# Altium project Controller_TRK.PrjPcb
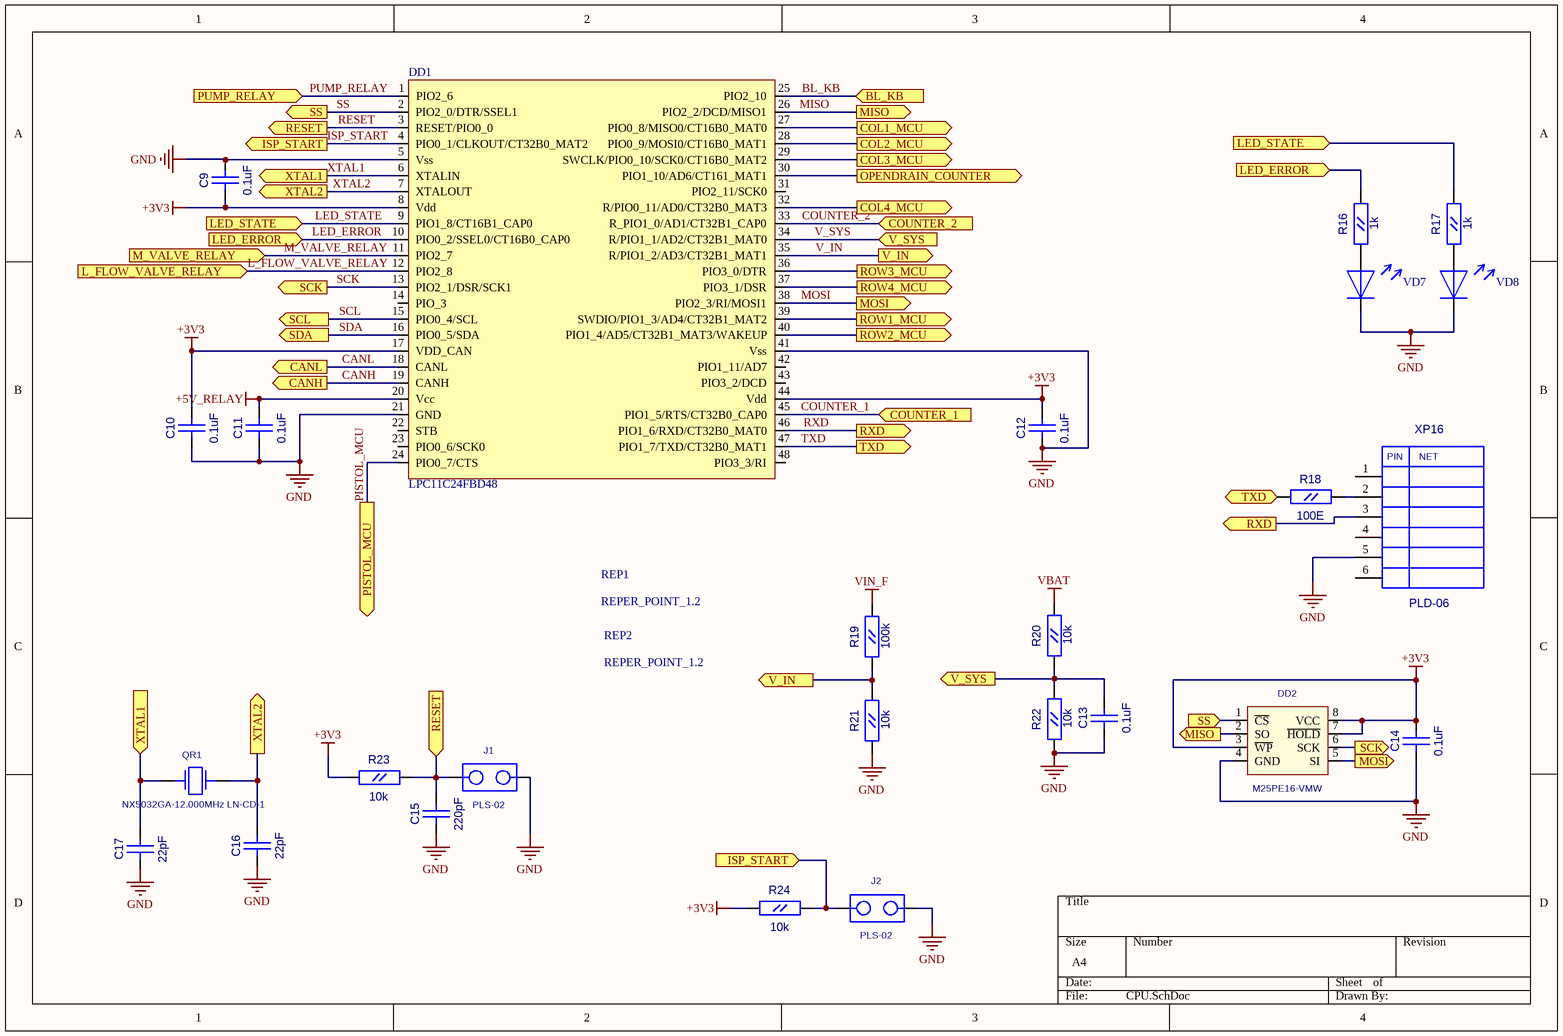
[diagram p0: CPU.SchDoc]
9 sheets, 192 parts. Net scope: flat (ports and power ports of the same name join across sheets).
Board file: Controller_TRK.PcbDoc
Sheets:
  CPU.SchDoc
  Keyboard.SchDoc
  Connections.SchDoc
  Relay.SchDoc
  Input.SchDoc
  Battery.SchDoc
  Power.SchDoc
  Power_1.SchDoc
  5V_Source.SchDoc

## Sheet CPU.SchDoc
size A4

### Parts
C9  0.1uF  [CC0603]
C10  0.1uF  [CC0603]
C11  0.1uF  [CC0603]
C12  0.1uF  [CC0603]
C13  0.1uF  [CC0603]
C14  0.1uF  [CC0603]
C15  220pF  [CC0603]
C16  22pF  [CC0603]
C17  22pF  [CC0603]
DD1  LPC11C24FBD48  [LQFP-48]
DD2  M25PE16-VMW  [EIAJ_SO8]
J1  PLS-02  [PLS-02]
J2  PLS-02  [PLS-02]
QR1  NX5032GA-12.000MHz LN-CD-1  [AC5032_2]
R16  1k  [RC0603]
R17  1k  [RC0603]
R18  100E  [RC0603]
R19  100k  [RC0603]
R20  10k  [RC0603]
R21  10k  [RC0603]
R22  10k  [RC0603]
R23  10k  [RC0603]
R24  10k  [RC0603]
REP1  REPER_POINT_1.2  [REPER1.2]
REP2  REPER_POINT_1.2  [REPER1.2]
VD7  LED_0805  [LED0805]  (value not drawn)
VD8  LED_0805  [LED0805]  (value not drawn)
XP16  PLD-06  [PIN6]

### Ports
BL_KB (in), CANH (out), CANL (out), COL1_MCU (out), COL2_MCU (out), COL3_MCU (out), COL4_MCU (out), COUNTER_1 (in), COUNTER_2 (in), ISP_START (in), ISP_START (out), L_FLOW_VALVE_RELAY (in), LED_ERROR (in), LED_STATE (in), M_VALVE_RELAY (in), MISO, MISO (out), MOSI, MOSI (out), OPENDRAIN_COUNTER (out), PISTOL_MCU (out), PUMP_RELAY (in), RESET (in), RESET (out), ROW1_MCU (out), ROW2_MCU (out), ROW3_MCU (out), ROW4_MCU (out), RXD (out), SCK, SCK (out), SCL (out), SDA (out), SS (in), SS (out), TXD (in), TXD (out), V_IN (out), V_SYS (in), V_SYS (out), XTAL1 (in), XTAL1 (out), XTAL2 (out)

### Nets
+3V3: C9.1(A) C10.2(B) C12.2(B) C14.2(B) DD1.8(Vdd) DD1.17(VDD_CAN) DD1.44(Vdd) DD2.3(~{WP}) DD2.7(~{HOLD}) DD2.8(VCC) R23.1(A) R24.1(A)
+5V_RELAY: C11.2(B) DD1.20(Vcc)
GND: C9.2(B) C10.1(A) C11.1(A) C12.1(A) C13.1(A) C14.1(A) C15.1(A) C16.1(A) C17.1(A) DD1.5(Vss) DD1.21(GND) DD1.41(Vss) DD2.4(GND) J1.2 J2.2 R21.1(A) R22.1(A) VD7.2 VD8.2 XP16.5
VBAT: R20.2(B)
VIN_F: R19.2(B)
BL_KB: DD1.25(PIO2_10) ; port BL_KB
CANH: DD1.19(CANH) ; port CANH
CANL: DD1.18(CANL) ; port CANL
COUNTER_1: DD1.45(PIO1_5/RTS/CT32B0_CAP0) ; port COUNTER_1
COUNTER_2: DD1.33(R_PIO1_0/AD1/CT32B1_CAP0) ; port COUNTER_2
ISP_START: DD1.4(PIO0_1/CLKOUT/CT32B0_MAT2) J2.1 R24.2(B) ; port ISP_START
L_FLOW_VALVE_RELAY: DD1.12(PIO2_8) ; port L_FLOW_VALVE_RELAY
LED_ERROR: DD1.10(PIO0_2/SSEL0/CT16B0_CAP0) R16.2(B) ; port LED_ERROR
LED_STATE: DD1.9(PIO1_8/CT16B1_CAP0) R17.2(B) ; port LED_STATE
M_VALVE_RELAY: DD1.11(PIO2_7) ; port M_VALVE_RELAY
MISO: DD1.26(PIO2_2/DCD/MISO1) DD2.2(SO) ; port MISO
MOSI: DD1.38(PIO2_3/RI/MOSI1) DD2.5(SI) ; port MOSI
PISTOL_MCU: DD1.24(PIO0_7/CTS) ; port PISTOL_MCU
PUMP_RELAY: DD1.1(PIO2_6) ; port PUMP_RELAY
RESET: C15.2(B) DD1.3(RESET/PIO0_0) J1.1 R23.2(B) ; port RESET
RXD: DD1.46(PIO1_6/RXD/CT32B0_MAT0) XP16.3 ; port RXD
SCK: DD1.13(PIO2_1/DSR/SCK1) DD2.6(SCK) ; port SCK
SCL: DD1.15(PIO0_4/SCL) ; port SCL
SDA: DD1.16(PIO0_5/SDA) ; port SDA
SS: DD1.2(PIO2_0/DTR/SSEL1) DD2.1(~{CS}) ; port SS
TXD: DD1.47(PIO1_7/TXD/CT32B0_MAT1) R18.1(A) ; port TXD
V_IN: DD1.35(R/PIO1_2/AD3/CT32B1_MAT1) R19.1(A) R21.2(B) ; port V_IN
V_SYS: C13.2(B) DD1.34(R/PIO1_1/AD2/CT32B1_MAT0) R20.1(A) R22.2(B) ; port V_SYS
XTAL1: C17.2(B) DD1.6(XTALIN) QR1.1 ; port XTAL1
XTAL2: C16.2(B) DD1.7(XTALOUT) QR1.2 ; port XTAL2
NetDD1_27: DD1.27(PIO0_8/MISO0/CT16B0_MAT0) ; port COL1_MCU
NetDD1_28: DD1.28(PIO0_9/MOSI0/CT16B0_MAT1) ; port COL2_MCU
NetDD1_29: DD1.29(SWCLK/PIO0_10/SCK0/CT16B0_MAT2) ; port COL3_MCU
NetDD1_30: DD1.30(PIO1_10/AD6/CT161_MAT1) ; port OPENDRAIN_COUNTER
NetDD1_32: DD1.32(R/PIO0_11/AD0/CT32B0_MAT3) ; port COL4_MCU
NetDD1_36: DD1.36(PIO3_0/DTR) ; port ROW3_MCU
NetDD1_37: DD1.37(PIO3_1/DSR) ; port ROW4_MCU
NetDD1_39: DD1.39(SWDIO/PIO1_3/AD4/CT32B1_MAT2) ; port ROW1_MCU
NetDD1_40: DD1.40(PIO1_4/AD5/CT32B1_MAT3/WAKEUP) ; port ROW2_MCU
NetR16_1: R16.1(A) VD7.1
NetR17_1: R17.1(A) VD8.1
NetR18_2: R18.2(B) XP16.2

Not connected (* = marked no-connect by the designer): DD1 14(PIO_3) 22(STB) 23(PIO0_6/SCK0) 31(PIO2_11/SCK0) 42(PIO1_11/AD7) 43(PIO3_2/DCD) 48(PIO3_3/RI); REP1 1; REP2 1; XP16 1 4 6

### Notes on the sheet
- (in symbol PLD-06) PIN; NET

### Library data of the parts
C9-C17 = CC0603
  C9-C14: Value: 0.1uF
  C15: Value: 220pF
  C16 C17: Value: 22pF
DD2 = S25FL016A0LMFI01: Value: M25PE16-VMW
QR1 = AC5032_2: AC5032/2; Value: NX5032GA-12.000MHz LN-CD-1
R16-R24 = RC0603
  R16 R17: Value: 1k
  R18: Value: 100E
  R19: Value: 100k
  R20-R24: Value: 10k
REP1 REP2 = REPER1.2: Value: REPER_POINT_1.2
XP16 = PLD-06: PLD06; Value: *
DD1 = LPC11C24FBD48: Value: LPC11C24FBD48
J1 J2 = PLS-02: Value: *
VD7 VD8 = LED_0805: Value: LED_0805

## Sheet Keyboard.SchDoc
size A4
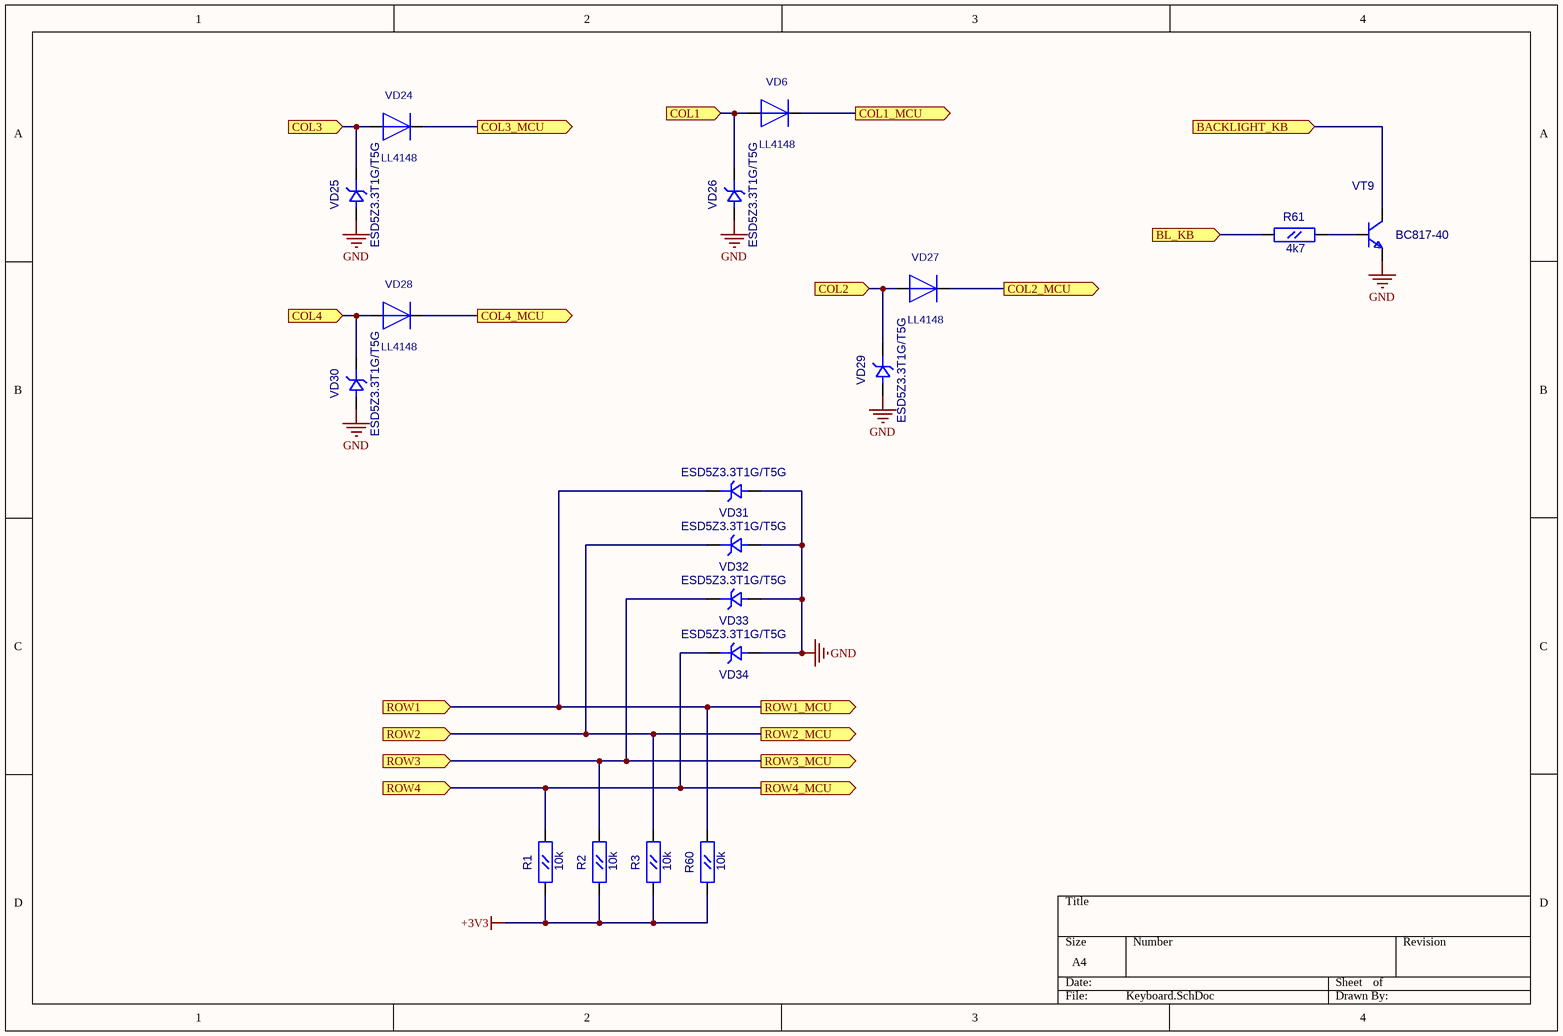
[diagram p1: Keyboard.SchDoc]

### Parts
R1  10k  [RC0603]
R2  10k  [RC0603]
R3  10k  [RC0603]
R60  10k  [RC0603]
R61  4k7  [RC0603]
VD6  LL4148  [SOD-80]
VD24  LL4148  [SOD-80]
VD25  ESD5Z3.3T1G/T5G  [SOD-523]
VD26  ESD5Z3.3T1G/T5G  [SOD-523]
VD27  LL4148  [SOD-80]
VD28  LL4148  [SOD-80]
VD29  ESD5Z3.3T1G/T5G  [SOD-523]
VD30  ESD5Z3.3T1G/T5G  [SOD-523]
VD31  ESD5Z3.3T1G/T5G  [SOD-523]
VD32  ESD5Z3.3T1G/T5G  [SOD-523]
VD33  ESD5Z3.3T1G/T5G  [SOD-523]
VD34  ESD5Z3.3T1G/T5G  [SOD-523]
VT9  BC817-40  [SOT-23(123)]

### Ports
BACKLIGHT_KB (in), BL_KB (in), COL1 (in), COL1_MCU (out), COL2 (in), COL2_MCU (out), COL3 (in), COL3_MCU (out), COL4 (in), COL4_MCU (out), ROW1 (in), ROW1_MCU (out), ROW2 (in), ROW2_MCU (out), ROW3 (in), ROW3_MCU (out), ROW4 (in), ROW4_MCU (out)

### Nets
+3V3: R1.1(A) R2.1(A) R3.1(A) R60.1(A)
GND: VD25.1(A) VD26.1(A) VD29.1(A) VD30.1(A) VD31.1(A) VD32.1(A) VD33.1(A) VD34.1(A) VT9.2(E)
BL_KB: R61.1(A) ; port BL_KB
NetDD1_27: VD6.2(+) ; port COL1_MCU
NetDD1_28: VD27.2(+) ; port COL2_MCU
NetDD1_29: VD24.2(+) ; port COL3_MCU
NetDD1_32: VD28.2(+) ; port COL4_MCU
NetDD1_36: R2.2(B) VD33.2(K) ; port ROW3_MCU, port ROW3
NetDD1_37: R1.2(B) VD34.2(K) ; port ROW4_MCU, port ROW4
NetDD1_39: R60.2(B) VD31.2(K) ; port ROW1_MCU, port ROW1
NetDD1_40: R3.2(B) VD32.2(K) ; port ROW2_MCU, port ROW2
NetR61_2: R61.2(B) VT9.1(B)
NetVD6_1: VD6.1(-) VD26.2(K) ; port COL1
NetVD24_1: VD24.1(-) VD25.2(K) ; port COL3
NetVD27_1: VD27.1(-) VD29.2(K) ; port COL2
NetVD28_1: VD28.1(-) VD30.2(K) ; port COL4
NetVT9_3: VT9.3(C) ; port BACKLIGHT_KB

### Library data of the parts
R1-R3 R60 R61 = RC0603
  R1-R3 R60: Value: 10k
  R61: Value: 4k7
VD25 VD26 VD29-VD34 = ESD5Z: Supressor; Value: ESD5Z3.3T1G/T5G
VT9 = BC846BLT1: NPN 500ma transistor; ComponentField7: Published 29-Sep-2000; OriginalName: BC846BLT1; Value: BC817-40
VD6 VD24 VD27 VD28 = LL4148: Value: *

## Sheet Connections.SchDoc
size A4
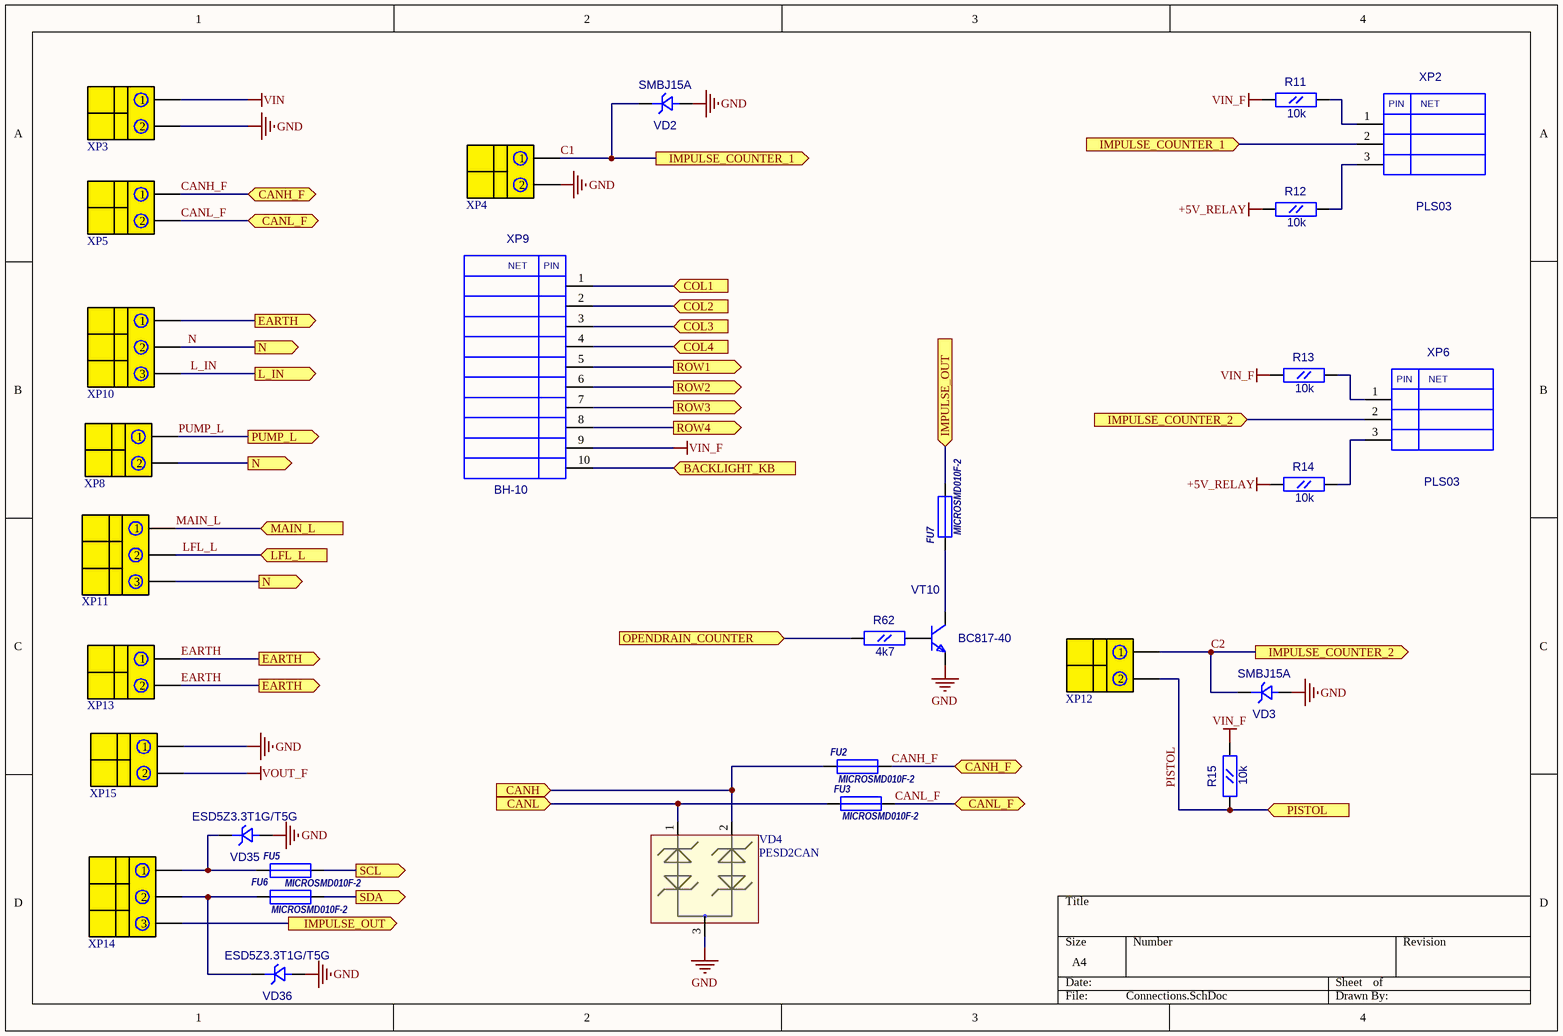
[diagram p2: Connections.SchDoc]

### Parts
FU2  MICROSMD010F-2  [RC1210]
FU3  MICROSMD010F-2  [RC1210]
FU5  MICROSMD010F-2  [RC1210]
FU6  MICROSMD010F-2  [RC1210]
FU7  MICROSMD010F-2  [RC1210]
R11  10k  [RC0603]
R12  10k  [RC0603]
R13  10k  [RC0603]
R14  10k  [RC0603]
R15  10k  [RC0603]
R62  4k7  [RC0603]
VD2  SMBJ15A  [SMB]
VD3  SMBJ15A  [SMB]
VD4  PESD2CAN  [SOT-23(123)]
VD35  ESD5Z3.3T1G/T5G  [SOD-523]
VD36  ESD5Z3.3T1G/T5G  [SOD-523]
VT10  BC817-40  [SOT-23(123)]
XP2  PLS03  [PLS-03]
XP3  DG330-2PIN  [DG330-2PIN]  (value not drawn)
XP4  DG330-2PIN  [DG330-2PIN]  (value not drawn)
XP5  DG330-2PIN  [DG330-2PIN]  (value not drawn)
XP6  PLS03  [PLS-03]
XP8  DG330-2PIN  [DG330-2PIN]  (value not drawn)
XP9  BH-10  [BH-10]
XP10  DG330-3PIN  [DG330-3PIN]  (value not drawn)
XP11  DG330-3PIN  [DG330-3PIN]  (value not drawn)
XP12  DG330-2PIN  [DG330-2PIN]  (value not drawn)
XP13  DG330-2PIN  [DG330-2PIN]  (value not drawn)
XP14  DG330-3PIN  [DG330-3PIN]  (value not drawn)
XP15  DG330-2PIN  [DG330-2PIN]  (value not drawn)

### Ports
BACKLIGHT_KB (in), CANH (in), CANH_F, CANL (in), CANL_F, COL1 (in), COL2 (in), COL3 (in), COL4 (in), EARTH (out), IMPULSE_COUNTER_1 (in), IMPULSE_COUNTER_1 (out), IMPULSE_COUNTER_2 (in), IMPULSE_COUNTER_2 (out), IMPULSE_OUT (in), IMPULSE_OUT (out), L_IN (out), LFL_L (in), MAIN_L (in), N (out), OPENDRAIN_COUNTER (in), PISTOL (in), PUMP_L (out), ROW1 (out), ROW2 (out), ROW3 (out), ROW4 (out), SCL (out), SDA (out)

### Nets
+5V_RELAY: R12.1(A) R14.1(A)
GND: VD2.1(A) VD3.1(A) VD4.3 VD35.1(A) VD36.1(A) VT10.2(E) XP3.2 XP4.2 XP15.1
VIN: XP3.1
VIN_F: R11.1(A) R13.1(A) R15.2(B) XP9.9
VOUT_F: XP15.2
C1: VD2.2(K) XP2.2 XP4.1 ; port IMPULSE_COUNTER_1
C2: VD3.2(K) XP6.2 XP12.1 ; port IMPULSE_COUNTER_2
CANH: FU2.1 VD4.2 ; port CANH
CANH_F: FU2.2 XP5.1 ; port CANH_F
CANL: FU3.1 VD4.1 ; port CANL
CANL_F: FU3.2 XP5.2 ; port CANL_F
EARTH: XP10.1 XP13.1 XP13.2 ; port EARTH
L_IN: XP10.3 ; port L_IN
LFL_L: XP11.2 ; port LFL_L
MAIN_L: XP11.1 ; port MAIN_L
N: XP8.2 XP10.2 XP11.3 ; port N
PISTOL: R15.1(A) XP12.2 ; port PISTOL
PUMP_L: XP8.1 ; port PUMP_L
SCL: FU5.2 ; port SCL
SDA: FU6.2 ; port SDA
NetDD1_30: R62.1(A) ; port OPENDRAIN_COUNTER
NetDD1_36: XP9.7 ; port ROW3
NetDD1_37: XP9.8 ; port ROW4
NetDD1_39: XP9.5 ; port ROW1
NetDD1_40: XP9.6 ; port ROW2
NetFU5_1: FU5.1 VD35.2(K) XP14.1
NetFU6_1: FU6.1 VD36.2(K) XP14.2
NetFU7_1: FU7.1 VT10.3(C)
NetFU7_2: FU7.2 XP14.3 ; port IMPULSE_OUT
NetR11_2: R11.2(B) XP2.1
NetR12_2: R12.2(B) XP2.3
NetR13_2: R13.2(B) XP6.1
NetR14_2: R14.2(B) XP6.3
NetR62_2: R62.2(B) VT10.1(B)
NetVD6_1: XP9.1 ; port COL1
NetVD24_1: XP9.3 ; port COL3
NetVD27_1: XP9.2 ; port COL2
NetVD28_1: XP9.4 ; port COL4
NetVT9_3: XP9.10 ; port BACKLIGHT_KB

### Notes on the sheet
- (in symbol BH-10) NET; PIN
- (in symbol PLS03) PIN; NET

### Library data of the parts
FU2 FU3 FU5-FU7 = MICROSMD
  FU2 FU3 FU5 FU6: Value: MICROSMD010F-2
  FU7: Value: *
R11-R15 R62 = RC0603
  R11-R15: Value: 10k
  R62: Value: 4k7
VD2 VD3 = SMBJ: Value: SMBJ15A
VD4 = PESD2CAN: TVS for CAN
VD35 VD36 = ESD5Z: Supressor; Value: ESD5Z3.3T1G/T5G
VT10 = BC846BLT1: as VT9 on sheet Keyboard; OriginalName: BC846BLT1; Value: BC817-40
XP2 XP6 = PLS03: Value: *
XP3-XP5 XP8 XP12 XP13 XP15 = DG330-2PIN: Value: DG330-2PIN
XP9 = BH-10: Value: *
XP10 XP11 XP14 = DG330-3PIN: Value: DG330-3PIN

## Sheet Relay.SchDoc
size A4
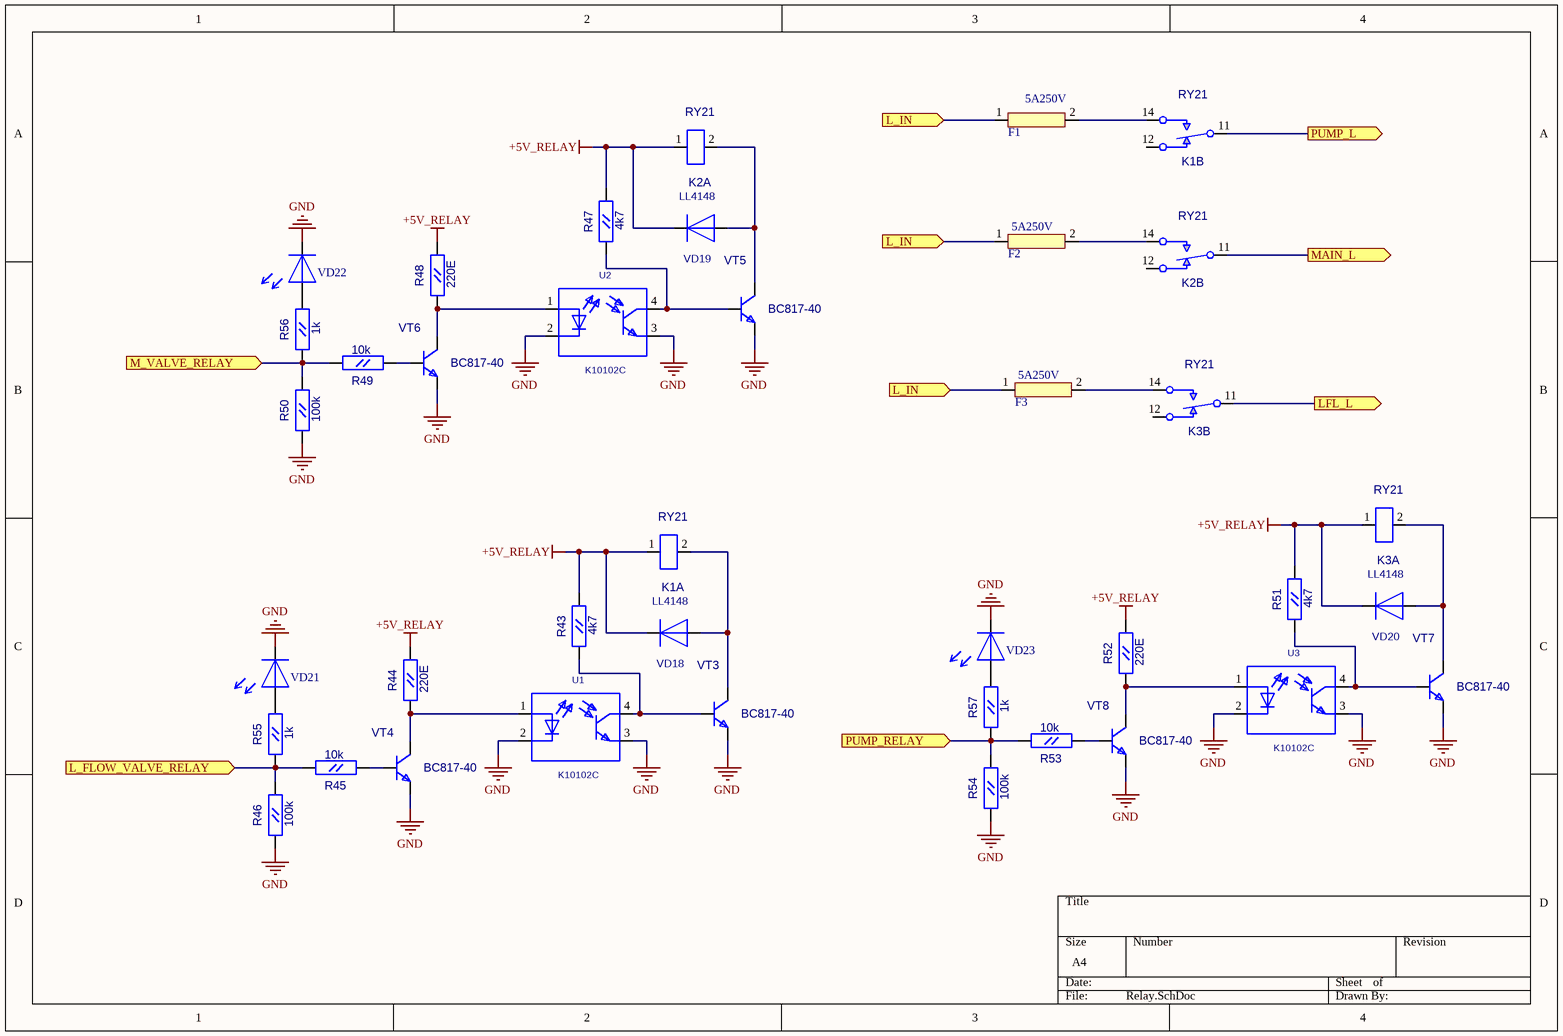
[diagram p3: Relay.SchDoc]

### Parts
F1  KLS5-266(5x20) 2pcs  [Fuse_5x20]  (value not drawn)
F2  KLS5-266(5x20) 2pcs  [Fuse_5x20]  (value not drawn)
F3  KLS5-266(5x20) 2pcs  [Fuse_5x20]  (value not drawn)
K1  RY21  [RY21_RY21(Primary)]  (parts A,B of 2)
K2  RY21  [RY21_RY21(Primary)]  (parts A,B of 2)
K3  RY21  [RY21_RY21(Primary)]  (parts A,B of 2)
R43  4k7  [RC0603]
R44  220E  [RC0603]
R45  10k  [RC0603]
R46  100k  [RC0603]
R47  4k7  [RC0603]
R48  220E  [RC0603]
R49  10k  [RC0603]
R50  100k  [RC0603]
R51  4k7  [RC0603]
R52  220E  [RC0603]
R53  10k  [RC0603]
R54  100k  [RC0603]
R55  1k  [RC0603]
R56  1k  [RC0603]
R57  1k  [RC0603]
U1  K10102C  [PC817]
U2  K10102C  [PC817]
U3  K10102C  [PC817]
VD18  LL4148  [SOD-80]
VD19  LL4148  [SOD-80]
VD20  LL4148  [SOD-80]
VD21  LED_0805  [LED0805]  (value not drawn)
VD22  LED_0805  [LED0805]  (value not drawn)
VD23  LED_0805  [LED0805]  (value not drawn)
VT3  BC817-40  [SOT-23(123)]
VT4  BC817-40  [SOT-23(123)]
VT5  BC817-40  [SOT-23(123)]
VT6  BC817-40  [SOT-23(123)]
VT7  BC817-40  [SOT-23(123)]
VT8  BC817-40  [SOT-23(123)]

### Ports
L_FLOW_VALVE_RELAY (in), L_IN (in), LFL_L (out), M_VALVE_RELAY (in), MAIN_L (out), PUMP_L (out), PUMP_RELAY (in)

### Nets
+5V_RELAY: K1.1(L1) K2.1(L1) K3.1(L1) R43.2(B) R44.2(B) R47.2(B) R48.2(B) R51.2(B) R52.2(B) VD18.2(+) VD19.2(+) VD20.2(+)
GND: R46.1(A) R50.1(A) R54.1(A) U1.2 U1.3 U2.2 U2.3 U3.2 U3.3 VD21.2 VD22.2 VD23.2 VT3.2(E) VT4.2(E) VT5.2(E) VT6.2(E) VT7.2(E) VT8.2(E)
L_FLOW_VALVE_RELAY: R45.2(B) R46.2(B) R55.1(A) ; port L_FLOW_VALVE_RELAY
L_IN: F1.1 F2.1 F3.1 ; port L_IN
LFL_L: K3.11(C1) ; port LFL_L
M_VALVE_RELAY: R49.2(B) R50.2(B) R56.1(A) ; port M_VALVE_RELAY
MAIN_L: K2.11(C1) ; port MAIN_L
PUMP_L: K1.11(C1) ; port PUMP_L
PUMP_RELAY: R53.2(B) R54.2(B) R57.1(A) ; port PUMP_RELAY
NetF1_2: F1.2 K1.14(C2)
NetF2_2: F2.2 K2.14(C2)
NetF3_2: F3.2 K3.14(C2)
NetK1_2: K1.2(C2) VD18.1(-) VT3.3(C)
NetK2_2: K2.2(C2) VD19.1(-) VT5.3(C)
NetK3_2: K3.2(C2) VD20.1(-) VT7.3(C)
NetR43_1: R43.1(A) U1.4 VT3.1(B)
NetR44_1: R44.1(A) U1.1 VT4.3(C)
NetR45_1: R45.1(A) VT4.1(B)
NetR47_1: R47.1(A) U2.4 VT5.1(B)
NetR48_1: R48.1(A) U2.1 VT6.3(C)
NetR49_1: R49.1(A) VT6.1(B)
NetR51_1: R51.1(A) U3.4 VT7.1(B)
NetR52_1: R52.1(A) U3.1 VT8.3(C)
NetR53_1: R53.1(A) VT8.1(B)
NetR55_2: R55.2(B) VD21.1
NetR56_2: R56.2(B) VD22.1
NetR57_2: R57.2(B) VD23.1

Not connected (* = marked no-connect by the designer): K1 12(C3); K2 12(C3); K3 12(C3)

### Notes on the sheet
- (near F1) 5A250V
- (near F2) 5A250V
- (near F3) 5A250V

### Library data of the parts
F1-F3 = Fuse KLS5-266(5x20): Value: KLS5-266(5x20) 2pcs
R43-R57 = RC0603
  R43 R47 R51: Value: 4k7
  R44 R48 R52: Value: 220E
  R45 R49 R53: Value: 10k
  R46 R50 R54: Value: 100k
  R55-R57: Value: 1k
VT3-VT8 = BC846BLT1: as VT9 on sheet Keyboard; OriginalName: BC846BLT1; Value: BC817-40
K1-K3 = RY21: Value: *
U1-U3 = K10102C: Value: *
VD18-VD20 = LL4148: Value: *
VD21-VD23 = LED_0805: Value: LED_0805

## Sheet Input.SchDoc
size A4
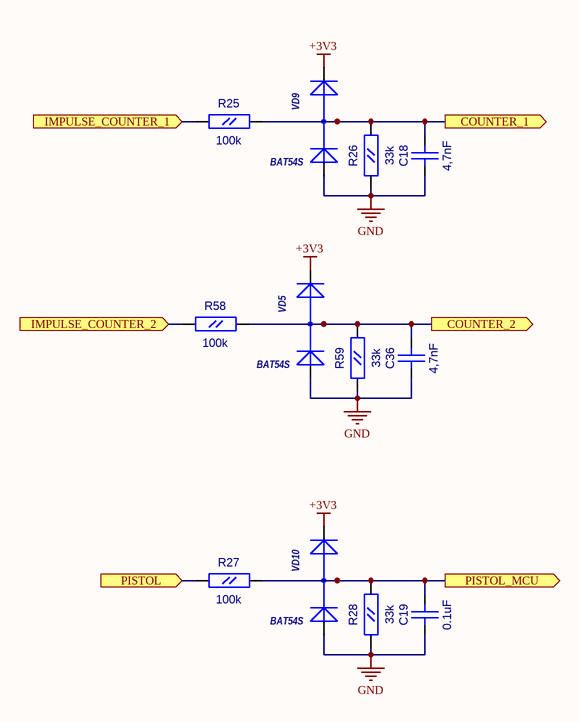
[diagram p4: Input.SchDoc]

### Parts
C18  4,7nF  [CC0603]
C19  0.1uF  [CC0603]
C36  4,7nF  [CC0603]
R25  100k  [RC0603]
R26  33k  [RC0603]
R27  100k  [RC0603]
R28  33k  [RC0603]
R58  100k  [RC0603]
R59  33k  [RC0603]
VD5  BAT54S  [SOT-23(GSD)]
VD9  BAT54S  [SOT-23(GSD)]
VD10  BAT54S  [SOT-23(GSD)]

### Ports
COUNTER_1 (out), COUNTER_2 (out), IMPULSE_COUNTER_1 (in), IMPULSE_COUNTER_2 (in), PISTOL (in), PISTOL_MCU (out)

### Nets
+3V3: VD5.2(K) VD9.2(K) VD10.2(K)
GND: C18.1(A) C19.1(A) C36.1(A) R26.1(A) R28.1(A) R59.1(A) VD5.1(A) VD9.1(A) VD10.1(A)
C1: R25.1(A) ; port IMPULSE_COUNTER_1
C2: R58.1(A) ; port IMPULSE_COUNTER_2
COUNTER_1: C18.2(B) R25.2(B) R26.2(B) VD9.3(AK) ; port COUNTER_1
COUNTER_2: C36.2(B) R58.2(B) R59.2(B) VD5.3(AK) ; port COUNTER_2
PISTOL: R27.1(A) ; port PISTOL
PISTOL_MCU: C19.2(B) R27.2(B) R28.2(B) VD10.3(AK) ; port PISTOL_MCU

### Library data of the parts
C18 C19 C36 = CC0603
  C18 C36: Value: 4,7nF
  C19: Value: 0.1uF
R25-R28 R58 R59 = RC0603
  R25 R27 R58: Value: 100k
  R26 R28 R59: Value: 33k
VD5 VD9 VD10 = BAT54S: 1.0 Ampere General Purpose Rectifier; ComponentField6: Published 8-Jun-2000, Modified 11-July-2000: SIM Model Added.; Value: *

## Sheet Battery.SchDoc
size A4
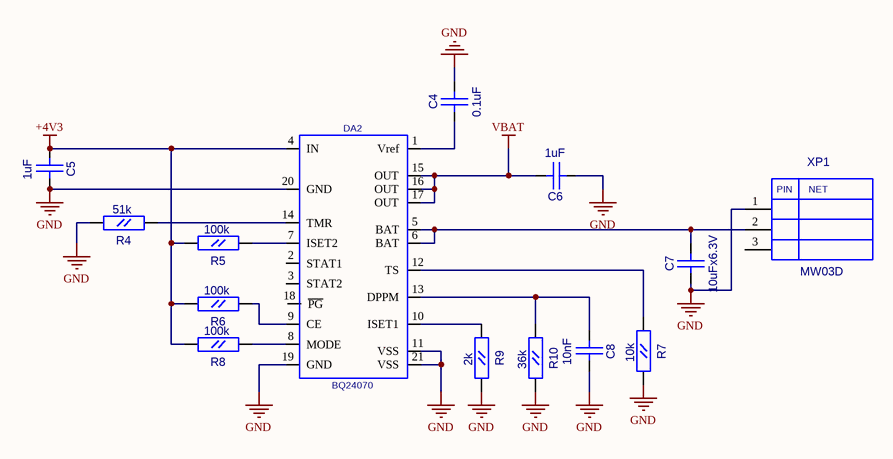
[diagram p5: Battery.SchDoc]

### Parts
C4  0.1uF  [CC0603]
C5  1uF  [CC0603]
C6  1uF  [CC0603]
C7  10uFx6.3V  [CC0805]
C8  10nF  [CC0603]
DA2  BQ24070  [P-PQFP-N20]
R4  51k  [RC0603]
R5  100k  [RC0603]
R6  100k  [RC0603]
R7  10k  [RC0603]
R8  100k  [RC0603]
R9  2k  [RC0603]
R10  36k  [RC0603]
XP1  MW03D  [MW03D]

### Nets
+4V3: C5.1(A) DA2.4(IN) R5.2(B) R6.2(B) R8.2(B)
GND: C4.2(B) C5.2(B) C6.1(A) C7.1(A) C8.2(B) DA2.11(VSS) DA2.19(GND) DA2.20(GND) DA2.21(VSS) R4.2(B) R7.2(B) R9.2(B) R10.2(B) XP1.1
VBAT: C6.2(B) DA2.15(OUT) DA2.16(OUT) DA2.17(OUT)
NetC4_1: C4.1(A) DA2.1(Vref)
NetC7_2: C7.2(B) DA2.5(BAT) DA2.6(BAT) XP1.2
NetC8_1: C8.1(A) DA2.13(DPPM) R10.1(A)
NetDA2_7: DA2.7(ISET2) R5.1(A)
NetDA2_8: DA2.8(MODE) R8.1(A)
NetDA2_9: DA2.9(CE) R6.1(A)
NetDA2_10: DA2.10(ISET1) R9.1(A)
NetDA2_12: DA2.12(TS) R7.1(A)
NetDA2_14: DA2.14(TMR) R4.1(A)

Not connected (* = marked no-connect by the designer): DA2 2(STAT1) 3(STAT2) 18(~{PG}); XP1 3

### Notes on the sheet
- (in symbol MW03D) PIN; NET

### Library data of the parts
C4-C6 C8 = CC0603
  C4: Value: 0.1uF
  C5 C6: Value: 1uF
  C8: Value: 10nF
C7 = CC0805: Value: 10uFx6.3V
R4-R10 = RC0603
  R4: Value: 51k
  R5 R6 R8: Value: 100k
  R7: Value: 10k
  R9: Value: 2k
  R10: Value: 36k
DA2 = BQ24070: Value: *
XP1 = MW03D: Value: *

## Sheet Power.SchDoc
size A4
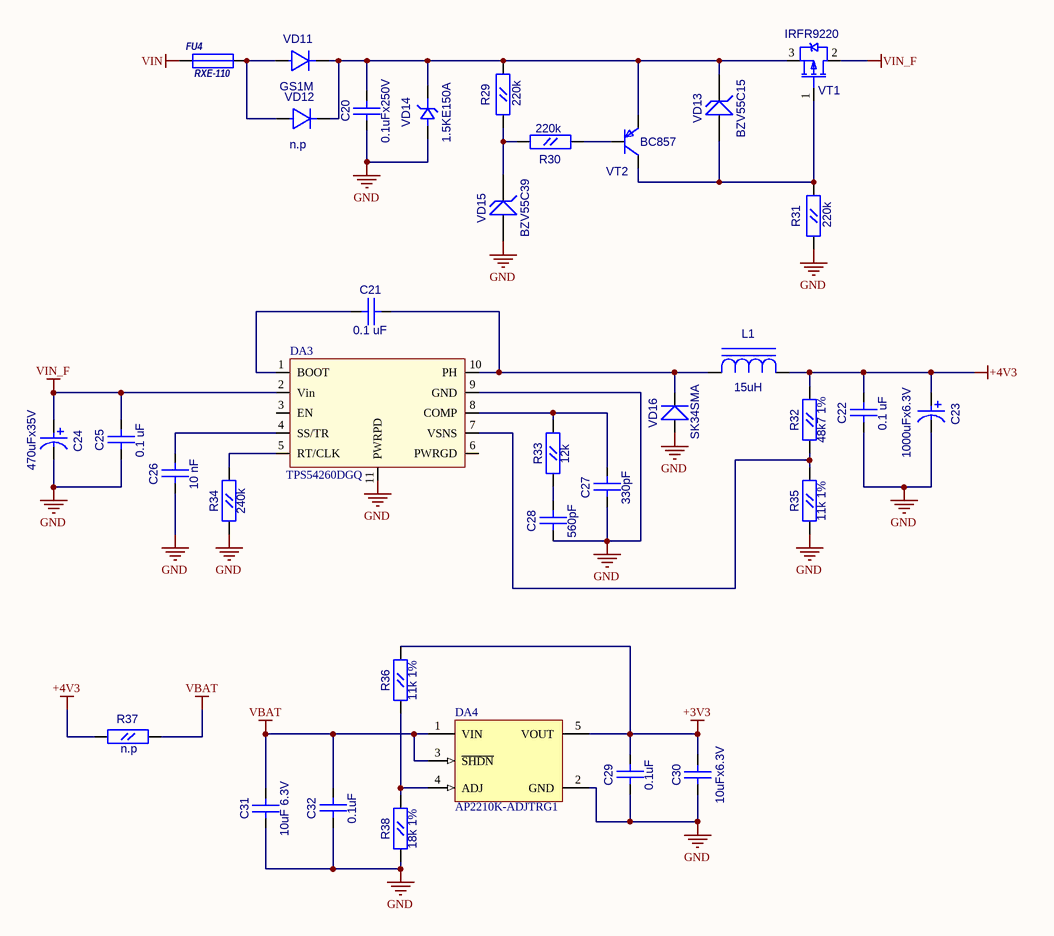
[diagram p6: Power.SchDoc]

### Parts
C20  0.1uFx250V  [CC1206]
C21  0.1 uF  [CC0603]
C22  0.1 uF  [CC0603]
C23  1000uFx6.3V  [CC8X3.5]
C24  470uFx35V  [CC16X10_CAP0.5(1)(Primary)]
C25  0.1 uF  [CC0603]
C26  10 nF  [CC0603]
C27  330pF  [CC0603]
C28  560pF  [CC0603]
C29  0.1uF  [CC0603]
C30  10uFx6.3V  [CC0805]
C31  10uF 6.3V  [CC0805]
C32  0.1uF  [CC0603]
DA3  TPS54260DGQ  [S-PDSO-G10]
DA4  AP2210K-ADJTRG1  [SOT23-5]
FU4  RXE-110  [RXE-110]
L1  15uH  [SDR0805]
R29  220k  [RC0603]
R30  220k  [RC0603]
R31  220k  [RC0603]
R32  48k7 1%  [RC0603]
R33  12k  [RC0603]
R34  240k  [RC0603]
R35  11k 1%  [RC0603]
R36  11k 1%  [RC0603]
R37  n.p  [RC0805]
R38  18k 1%  [RC0603]
VD11  GS1M  [SMA]
VD12  n.p  [SMA]
VD13  BZV55C15  [SOD-80]
VD14  1.5KE150A  [DO-201]
VD15  BZV55C39  [SOD-80]
VD16  SK34SMA  [SMA]
VT1  IRFR9220  [D-PAK(TO-252AA)]
VT2  BC857  [SOT-23(123)]

### Nets
+3V3: C29.1(A) C30.2(B) DA4.5(VOUT) R36.2(B)
+4V3: C22.1(A) C23.1 L1.2(A) R32.2(B) R37.1(A)
GND: C20.1(A) C22.2(B) C23.2 C24.1 C25.2(B) C26.2(B) C27.2(B) C28.2(B) C29.2(B) C30.1(A) C31.1(A) C32.2(B) DA3.9(GND) DA3.11(PWRPD) DA4.2(GND) R31.1(A) R34.1(A) R35.1(A) R38.1(A) VD14.1(A) VD15.1(A) VD16.1(A)
VBAT: C31.2(B) C32.1(A) DA4.1(VIN) DA4.3(~{SHDN}) R37.2(B)
VIN: FU4.1
VIN_F: C24.2 C25.1(A) DA3.2(Vin) VT1.2(D)
NetC20_2: C20.2(B) R29.2(B) VD11.2(K) VD12.2(K) VD13.2 VD14.2(K) VT1.3(S) VT2.2(E)
NetC21_1: C21.1(A) DA3.10(PH) L1.1(C) VD16.2(K)
NetC21_2: C21.2(B) DA3.1(BOOT)
NetC26_1: C26.1(A) DA3.4(SS/TR)
NetC27_1: C27.1(A) DA3.8(COMP) R33.2(B)
NetC28_1: C28.1(A) R33.1(A)
NetDA3_5: DA3.5(RT/CLK) R34.2(B)
NetDA3_7: DA3.7(VSNS) R32.1(A) R35.2(B)
NetDA4_4: DA4.4(ADJ) R36.1(A) R38.2(B)
NetFU4_2: FU4.2 VD11.1(A) VD12.1(A)
NetR29_1: R29.1(A) R30.2(B) VD15.2
NetR30_1: R30.1(A) VT2.1(B)
NetR31_2: R31.2(B) VD13.1(A) VT1.1(G) VT2.3(C)

Not connected (* = marked no-connect by the designer): DA3 3(EN) 6(PWRGD)

### Library data of the parts
C20 = CC1206: Value: 0.1uFx250V
C21 C22 C25-C29 C32 = CC0603
  C21 C22 C25: Value: 0.1 uF
  C26: Value: 10 nF
  C27: Value: 330pF
  C28: Value: 560pF
  C29 C32: Value: 0.1uF
C23 = CAP0.35: Value: 1000uFx6.3V
C24 = CAP0.5(1): Value: 470uFx35V
C30 C31 = CC0805
  C30: Value: 10uFx6.3V
  C31: Value: 10uF 6.3V
DA4 = MCP1824T-ADJE/OT: 300 mA, Low Voltage, Low Quiescent Current LDO Regulator, 5-Pin SOT-223, Extended Temperature, Tape and Reel; Published: 29-Jan-2009; DatasheetVersion: revA, Aug-2007; PackageVersion: revAW, Oct-2008; PackageReference: SOT-223-DC5; Publisher: Altium Limited; PackageDescription: 5-Lead Plastic Small Outline Transistor (DC) [SOT-223]; ComponentLink1Description: Manufacturer Link; ComponentLink1URL: http://www.microchip.com; ComponentLink2Description: Datasheet; ComponentLink2URL: http://ww1.microchip.com/downloads/en/DeviceDoc/22070a.pdf; ComponentLink3Description: Packaging Specification; ComponentLink3URL: http://ww1.microchip.com/downloads/en/PackagingSpec/00049AW.pdf
L1 = SDR0805: Value: 15uH
R29-R36 R38 = RC0603
  R29-R31: Value: 220k
  R32: Value: 48k7 1%
  R33: Value: 12k
  R34: Value: 240k
  R35 R36: Value: 11k 1%
  R38: Value: 18k 1%
R37 = RC0805: Value: n.p
VD11 = GS1M: Value: {Value}
VD12 = GS1M: Value: n.p
VD13 = BZV55C12: Zener Voltage Regulator Diode; Value: BZV55C15
VD14 = 1.5KE: Value: 1.5KE150A
VD15 = BZV55C12: Zener Voltage Regulator Diode; OriginalName: BXV55C39; ComponentField6: Pin 2 is not connected and not drawn.; ComponentField7: Published 29-Sep-2000; Value: BZV55C39
VD16 = SK34SMA: Schottky Rectifier; Value: {Value}
VT1 = IRFR9220: HEXFET Power MOSFET; OriginalName: IRLML5103; ComponentField7: Published 8-Jun-2000; Value: IRFR9220
VT2 = BC857B: PNP 100ma transistor; OriginalName: BC846BLT1; ComponentField7: Published 29-Sep-2000; Value: BC857
FU4 = RXE-110: Value: *

## Sheet Power_1.SchDoc
size A4
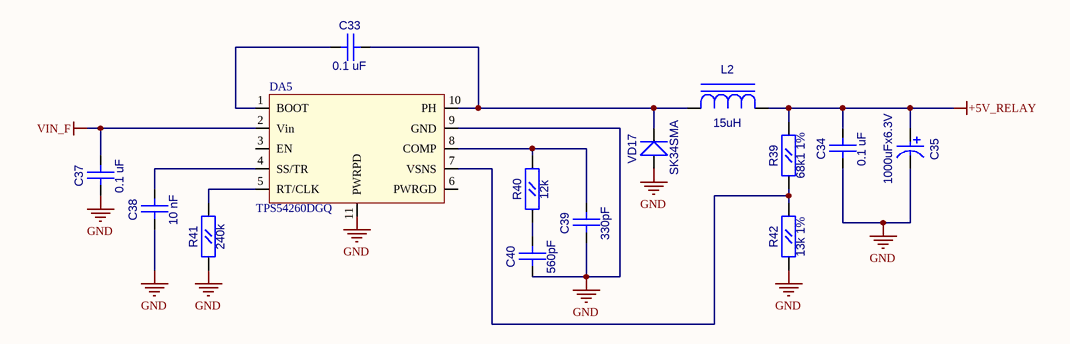
[diagram p7: Power_1.SchDoc]

### Parts
C33  0.1 uF  [CC0603]
C34  0.1 uF  [CC0603]
C35  1000uFx6.3V  [CC8X3.5]
C37  0.1 uF  [CC0603]
C38  10 nF  [CC0603]
C39  330pF  [CC0603]
C40  560pF  [CC0603]
DA5  TPS54260DGQ  [S-PDSO-G10]
L2  15uH  [SDR0805]
R39  68k1 1%  [RC0603]
R40  12k  [RC0603]
R41  240k  [RC0603]
R42  13k 1%  [RC0603]
VD17  SK34SMA  [SMA]

### Nets
+5V_RELAY: C34.1(A) C35.1 L2.2(A) R39.2(B)
GND: C34.2(B) C35.2 C37.2(B) C38.2(B) C39.2(B) C40.2(B) DA5.9(GND) DA5.11(PWRPD) R41.1(A) R42.1(A) VD17.1(A)
VIN_F: C37.1(A) DA5.2(Vin)
NetC33_1: C33.1(A) DA5.10(PH) L2.1(C) VD17.2(K)
NetC33_2: C33.2(B) DA5.1(BOOT)
NetC38_1: C38.1(A) DA5.4(SS/TR)
NetC39_1: C39.1(A) DA5.8(COMP) R40.2(B)
NetC40_1: C40.1(A) R40.1(A)
NetDA5_5: DA5.5(RT/CLK) R41.2(B)
NetDA5_7: DA5.7(VSNS) R39.1(A) R42.2(B)

Not connected (* = marked no-connect by the designer): DA5 3(EN) 6(PWRGD)

### Library data of the parts
C33 C34 C37-C40 = CC0603
  C33 C34 C37: Value: 0.1 uF
  C38: Value: 10 nF
  C39: Value: 330pF
  C40: Value: 560pF
C35 = CAP0.35: Value: 1000uFx6.3V
L2 = SDR0805: Value: 15uH
R39-R42 = RC0603
  R39: Value: 68k1 1%
  R40: Value: 12k
  R41: Value: 240k
  R42: Value: 13k 1%
VD17 = SK34SMA: Schottky Rectifier; Value: {Value}

## Sheet 5V_Source.SchDoc
size A4
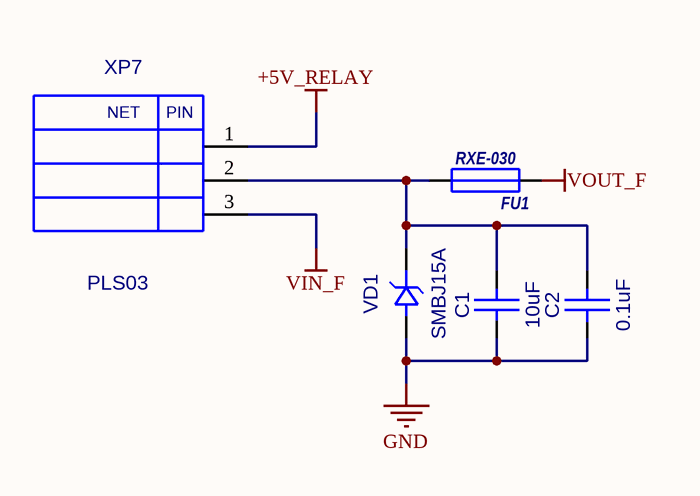
[diagram p8: 5V_Source.SchDoc]

### Parts
C1  10uF  [CC0805]
C2  0.1uF  [CC0603]
FU1  RXE-030  [RXE-110]
VD1  SMBJ15A  [SMB]
XP7  PLS03  [PLS-03]

### Nets
+5V_RELAY: XP7.1
GND: C1.1(A) C2.1(A) VD1.1(A)
VIN_F: XP7.3
VOUT_F: FU1.1
NetC1_2: C1.2(B) C2.2(B) FU1.2 VD1.2(K) XP7.2

### Notes on the sheet
- (in symbol PLS03) NET; PIN

### Library data of the parts
C1 = CC0805: Value: 10uF
C2 = CC0603: Value: 0.1uF
FU1 = RXE-110: Value: RXE-030
VD1 = SMBJ: Value: SMBJ15A
XP7 = PLS03: Value: *

## Nets that join several sheets
+3V3: CPU (12 pins), Keyboard (R1.1 R2.1 R3.1 R60.1), Input (VD5.2 VD9.2 VD10.2), Power (C29.1 C30.2 DA4.5 R36.2)
+4V3: Battery (5 pins), Power (5 pins)
+5V_RELAY: CPU (C11.2 DD1.20), Connections (R12.1 R14.1), Relay (12 pins), Power_1 (C34.1 C35.1 L2.2 R39.2), 5V_Source (XP7.1)
GND: CPU (20 pins), Keyboard (9 pins), Connections (9 pins), Relay (18 pins), Input (9 pins), Battery (14 pins), Power (22 pins), Power_1 (11 pins), 5V_Source (C1.1 C2.1 VD1.1)
VBAT: CPU (R20.2), Battery (C6.2 DA2.15 DA2.16 DA2.17), Power (5 pins)
VIN: Connections (XP3.1), Power (FU4.1)
VIN_F: CPU (R19.2), Connections (R11.1 R13.1 R15.2 XP9.9), Power (C24.2 C25.1 DA3.2 VT1.2), Power_1 (C37.1 DA5.2), 5V_Source (XP7.3)
VOUT_F: Connections (XP15.2), 5V_Source (FU1.1)
BL_KB: CPU (DD1.25), Keyboard (R61.1)
C1: Connections (VD2.2 XP2.2 XP4.1), Input (R25.1)
C2: Connections (VD3.2 XP6.2 XP12.1), Input (R58.1)
CANH: CPU (DD1.19), Connections (FU2.1 VD4.2)
CANL: CPU (DD1.18), Connections (FU3.1 VD4.1)
COUNTER_1: CPU (DD1.45), Input (C18.2 R25.2 R26.2 VD9.3)
COUNTER_2: CPU (DD1.33), Input (C36.2 R58.2 R59.2 VD5.3)
L_FLOW_VALVE_RELAY: CPU (DD1.12), Relay (R45.2 R46.2 R55.1)
L_IN: Connections (XP10.3), Relay (F1.1 F2.1 F3.1)
LFL_L: Connections (XP11.2), Relay (K3.11)
M_VALVE_RELAY: CPU (DD1.11), Relay (R49.2 R50.2 R56.1)
MAIN_L: Connections (XP11.1), Relay (K2.11)
NetDD1_27: CPU (DD1.27), Keyboard (VD6.2)
NetDD1_28: CPU (DD1.28), Keyboard (VD27.2)
NetDD1_29: CPU (DD1.29), Keyboard (VD24.2)
NetDD1_30: CPU (DD1.30), Connections (R62.1)
NetDD1_32: CPU (DD1.32), Keyboard (VD28.2)
NetDD1_36: CPU (DD1.36), Keyboard (R2.2 VD33.2), Connections (XP9.7)
NetDD1_37: CPU (DD1.37), Keyboard (R1.2 VD34.2), Connections (XP9.8)
NetDD1_39: CPU (DD1.39), Keyboard (R60.2 VD31.2), Connections (XP9.5)
NetDD1_40: CPU (DD1.40), Keyboard (R3.2 VD32.2), Connections (XP9.6)
NetVD6_1: Keyboard (VD6.1 VD26.2), Connections (XP9.1)
NetVD24_1: Keyboard (VD24.1 VD25.2), Connections (XP9.3)
NetVD27_1: Keyboard (VD27.1 VD29.2), Connections (XP9.2)
NetVD28_1: Keyboard (VD28.1 VD30.2), Connections (XP9.4)
NetVT9_3: Keyboard (VT9.3), Connections (XP9.10)
PISTOL: Connections (R15.1 XP12.2), Input (R27.1)
PISTOL_MCU: CPU (DD1.24), Input (C19.2 R27.2 R28.2 VD10.3)
PUMP_L: Connections (XP8.1), Relay (K1.11)
PUMP_RELAY: CPU (DD1.1), Relay (R53.2 R54.2 R57.1)
SCL: CPU (DD1.15), Connections (FU5.2)
SDA: CPU (DD1.16), Connections (FU6.2)